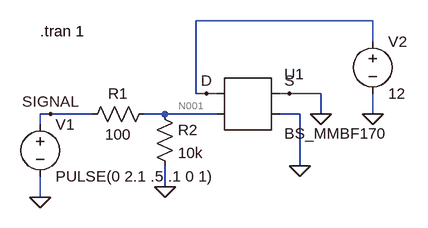
[diagram p0: schematic bs170.asc]
* bs170.asc
* U1: BS_MMBF170 (symbol AutoGenerated\BS_MMBF170 not available, pins judged from their places): pin1=D pin2=N001 pin3=0 pin4=0
R1 N001 SIGNAL 100
R2 N001 0 10k
V1 SIGNAL 0 PULSE(0 2.1 .5 .1 0 1)
V2 D 0 12
.tran 1
.backanno
.end

* Results of the author's LTspice run, read from the files saved beside the schematic
* Operating Point, zero values left out:
*   V(n001) = 120.1 µV
*   V(d) = 12 V
*   I(R2) = 12.01 nA
*   I(R1) = 1.201 µA
*   I(V2) = -1.213 µA
*   I(V1) = 1.201 µA
*   Ix(u1:20) = 1.213 µA
*   Ix(u1:10) = -1.213 µA
*   Ix(u1:30) = -49.96 pA
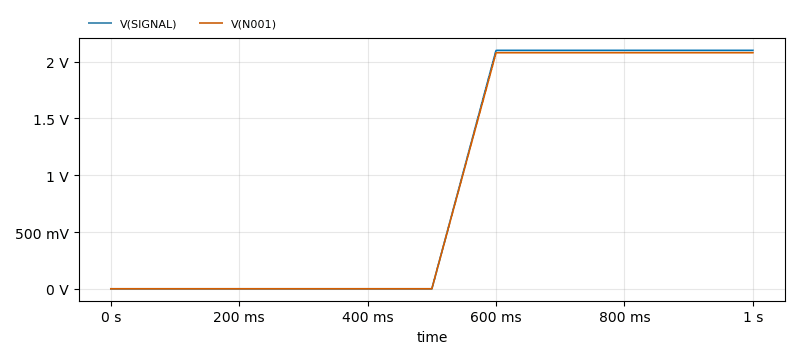
[diagram p1: Transient Analysis of bs170.asc, plotted from the saved traces]
* Transient Analysis, 1 run:
*   V(SIGNAL): min 0 V, max 2.1 V, average 945 mV, rms 1.409 V, last 2.1 V
*   V(N001): min 120.1 µV, max 2.079 V, average 935.8 mV, rms 1.395 V, last 2.079 V